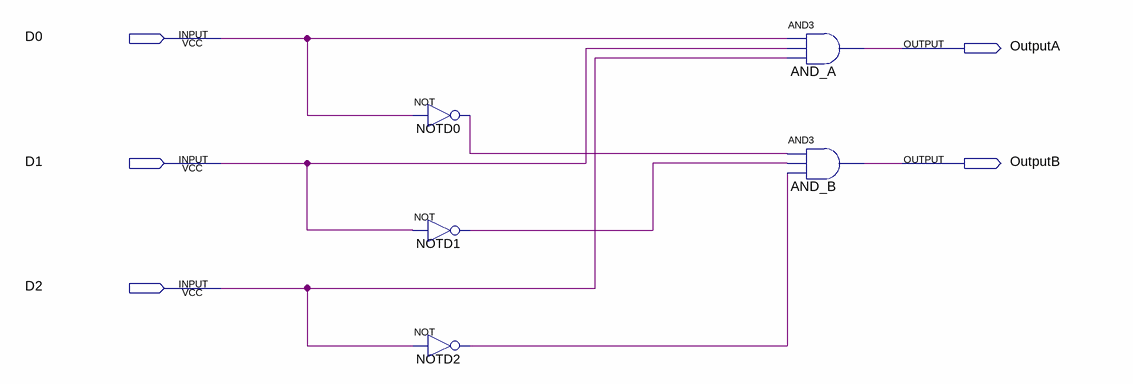
[diagram p0: schematic sheet]
// Quartus schematic YourPart.bdf as structural Verilog: 5 symbols, 5 pins
module YourPart (
  input  D0,
  input  D1,
  input  D2,
  output OutputA,
  output OutputB
);

  wire NOTD0_out, NOTD1_out, NOTD2_out;

  not NOTD0 (NOTD0_out, D0);
  not NOTD1 (NOTD1_out, D1);
  not NOTD2 (NOTD2_out, D2);
  and AND_A (OutputA, D0, D1, D2);
  and AND_B (OutputB, NOTD0_out, NOTD1_out, NOTD2_out);
endmodule
